# EAGLE schematic AP4BP-Module-CarrierBreakout_rev_a_v2 (EAGLE 9.7.0)
AUTHOR: Pat Pannuto; REV: B; TITLE: Apollo4-BluePlus-Module
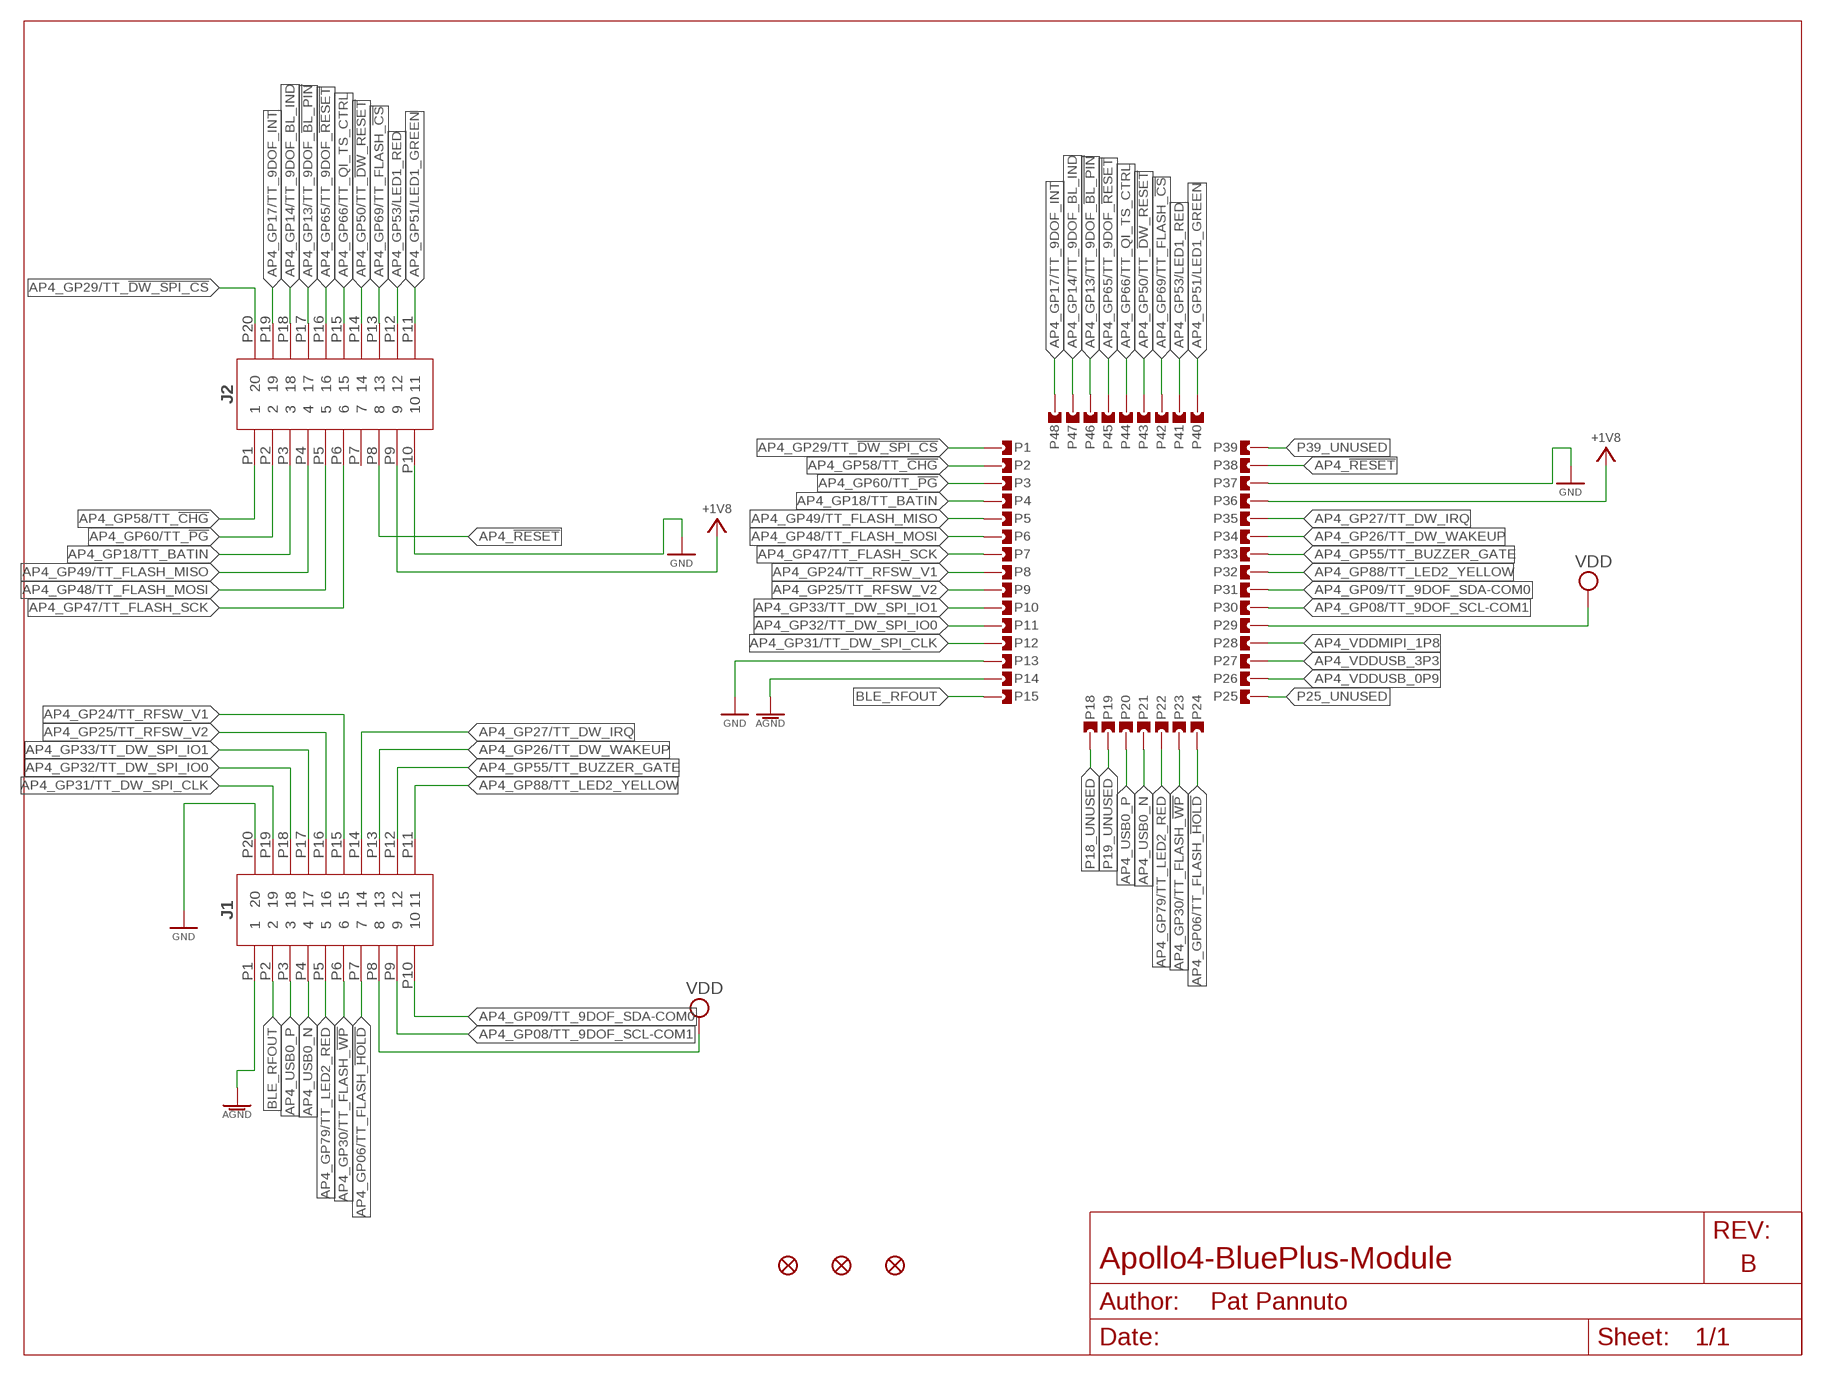
[diagram p0: schematic, sheet 1]

## Parts
FD1  FIDUCIALUFIDUCIAL  [FIDUCIAL-MICRO]
FD2  FIDUCIALUFIDUCIAL  [FIDUCIAL-MICRO]
FD3  FIDUCIALUFIDUCIAL  [FIDUCIAL-MICRO]
J1  PINHEAD-SMD-1MM-2X10  [PINHEAD-SMD-1MM-2X10]
J2  PINHEAD-SMD-1MM-2X10  [PINHEAD-SMD-1MM-2X10]
P1  CASTELLATION4L  [CASTELLATION-0.55MM_DRILL-4L]
P2  CASTELLATION4L  [CASTELLATION-0.55MM_DRILL-4L]
P3  CASTELLATION4L  [CASTELLATION-0.55MM_DRILL-4L]
P4  CASTELLATION4L  [CASTELLATION-0.55MM_DRILL-4L]
P5  CASTELLATION4L  [CASTELLATION-0.55MM_DRILL-4L]
P6  CASTELLATION4L  [CASTELLATION-0.55MM_DRILL-4L]
P7  CASTELLATION4L  [CASTELLATION-0.55MM_DRILL-4L]
P8  CASTELLATION4L  [CASTELLATION-0.55MM_DRILL-4L]
P9  CASTELLATION4L  [CASTELLATION-0.55MM_DRILL-4L]
P10  CASTELLATION4L  [CASTELLATION-0.55MM_DRILL-4L]
P11  CASTELLATION4L  [CASTELLATION-0.55MM_DRILL-4L]
P12  CASTELLATION4L  [CASTELLATION-0.55MM_DRILL-4L]
P13  CASTELLATION4L  [CASTELLATION-0.55MM_DRILL-4L]
P14  CASTELLATION4L  [CASTELLATION-0.55MM_DRILL-4L]
P15  CASTELLATION4L  [CASTELLATION-0.55MM_DRILL-4L]
P18  CASTELLATION4L  [CASTELLATION-0.55MM_DRILL-4L]
P19  CASTELLATION4L  [CASTELLATION-0.55MM_DRILL-4L]
P20  CASTELLATION4L  [CASTELLATION-0.55MM_DRILL-4L]
P21  CASTELLATION4L  [CASTELLATION-0.55MM_DRILL-4L]
P22  CASTELLATION4L  [CASTELLATION-0.55MM_DRILL-4L]
P23  CASTELLATION4L  [CASTELLATION-0.55MM_DRILL-4L]
P24  CASTELLATION4L  [CASTELLATION-0.55MM_DRILL-4L]
P25  CASTELLATION4L  [CASTELLATION-0.55MM_DRILL-4L]
P26  CASTELLATION4L  [CASTELLATION-0.55MM_DRILL-4L]
P27  CASTELLATION4L  [CASTELLATION-0.55MM_DRILL-4L]
P28  CASTELLATION4L  [CASTELLATION-0.55MM_DRILL-4L]
P29  CASTELLATION4L  [CASTELLATION-0.55MM_DRILL-4L]
P30  CASTELLATION4L  [CASTELLATION-0.55MM_DRILL-4L]
P31  CASTELLATION4L  [CASTELLATION-0.55MM_DRILL-4L]
P32  CASTELLATION4L  [CASTELLATION-0.55MM_DRILL-4L]
P33  CASTELLATION4L  [CASTELLATION-0.55MM_DRILL-4L]
P34  CASTELLATION4L  [CASTELLATION-0.55MM_DRILL-4L]
P35  CASTELLATION4L  [CASTELLATION-0.55MM_DRILL-4L]
P36  CASTELLATION4L  [CASTELLATION-0.55MM_DRILL-4L]
P37  CASTELLATION4L  [CASTELLATION-0.55MM_DRILL-4L]
P38  CASTELLATION4L  [CASTELLATION-0.55MM_DRILL-4L]
P39  CASTELLATION4L  [CASTELLATION-0.55MM_DRILL-4L]
P40  CASTELLATION4L  [CASTELLATION-0.55MM_DRILL-4L]
P41  CASTELLATION4L  [CASTELLATION-0.55MM_DRILL-4L]
P42  CASTELLATION4L  [CASTELLATION-0.55MM_DRILL-4L]
P43  CASTELLATION4L  [CASTELLATION-0.55MM_DRILL-4L]
P44  CASTELLATION4L  [CASTELLATION-0.55MM_DRILL-4L]
P45  CASTELLATION4L  [CASTELLATION-0.55MM_DRILL-4L]
P46  CASTELLATION4L  [CASTELLATION-0.55MM_DRILL-4L]
P47  CASTELLATION4L  [CASTELLATION-0.55MM_DRILL-4L]
P48  CASTELLATION4L  [CASTELLATION-0.55MM_DRILL-4L]

## Nets
+1V8: J2.P9 P36.P$1 P36.P$2 P36.P$3
AGND: J1.P1 P14.P$1 P14.P$2 P14.P$3
AP4_!RESET: J2.P8 P38.P$1 P38.P$2 P38.P$3
AP4_GP06/TT_FLASH_!HOLD: J1.P7 P24.P$1 P24.P$2 P24.P$3
AP4_GP08/TT_9DOF_SCL-COM1: J1.P9 P30.P$1 P30.P$2 P30.P$3
AP4_GP09/TT_9DOF_SDA-COM0: J1.P10 P31.P$1 P31.P$2 P31.P$3
AP4_GP13/TT_9DOF_!BL_PIN: J2.P17 P46.P$1 P46.P$2 P46.P$3
AP4_GP14/TT_9DOF_BL_IND: J2.P18 P47.P$1 P47.P$2 P47.P$3
AP4_GP17/TT_9DOF_INT: J2.P19 P48.P$1 P48.P$2 P48.P$3
AP4_GP18/TT_BATIN: J2.P3 P4.P$1 P4.P$2 P4.P$3
AP4_GP24/TT_RFSW_V1: J1.P15 P8.P$1 P8.P$2 P8.P$3
AP4_GP25/TT_RFSW_V2: J1.P16 P9.P$1 P9.P$2 P9.P$3
AP4_GP26/TT_DW_WAKEUP: J1.P13 P34.P$1 P34.P$2 P34.P$3
AP4_GP27/TT_DW_IRQ: J1.P14 P35.P$1 P35.P$2 P35.P$3
AP4_GP29/TT_!DW_SPI_CS: J2.P20 P1.P$1 P1.P$2 P1.P$3
AP4_GP30/TT_FLASH_!WP: J1.P6 P23.P$1 P23.P$2 P23.P$3
AP4_GP31/TT_DW_SPI_CLK: J1.P19 P12.P$1 P12.P$2 P12.P$3
AP4_GP32/TT_DW_SPI_IO0: J1.P18 P11.P$1 P11.P$2 P11.P$3
AP4_GP33/TT_DW_SPI_IO1: J1.P17 P10.P$1 P10.P$2 P10.P$3
AP4_GP47/TT_FLASH_SCK: J2.P6 P7.P$1 P7.P$2 P7.P$3
AP4_GP48/TT_FLASH_MOSI: J2.P5 P6.P$1 P6.P$2 P6.P$3
AP4_GP49/TT_FLASH_MISO: J2.P4 P5.P$1 P5.P$2 P5.P$3
AP4_GP50/TT_!DW_RESET: J2.P14 P43.P$1 P43.P$2 P43.P$3
AP4_GP51/LED1_GREEN: J2.P11 P40.P$1 P40.P$2 P40.P$3
AP4_GP53/LED1_RED: J2.P12 P41.P$1 P41.P$2 P41.P$3
AP4_GP55/TT_BUZZER_GATE: J1.P12 P33.P$1 P33.P$2 P33.P$3
AP4_GP58/TT_!CHG: J2.P1 P2.P$1 P2.P$2 P2.P$3
AP4_GP60/TT_!PG: J2.P2 P3.P$1 P3.P$2 P3.P$3
AP4_GP65/TT_9DOF_!RESET: J2.P16 P45.P$1 P45.P$2 P45.P$3
AP4_GP66/TT_QI_TS_CTRL: J2.P15 P44.P$1 P44.P$2 P44.P$3
AP4_GP69/TT_FLASH_!CS: J2.P13 P42.P$1 P42.P$2 P42.P$3
AP4_GP79/TT_LED2_RED: J1.P5 P22.P$1 P22.P$2 P22.P$3
AP4_GP88/TT_LED2_YELLOW: J1.P11 P32.P$1 P32.P$2 P32.P$3
AP4_USB0_N [USB_PHY]: J1.P4 P21.P$1 P21.P$2 P21.P$3
AP4_USB0_P [USB_PHY]: J1.P3 P20.P$1 P20.P$2 P20.P$3
AP4_VDDMIPI_1P8: P28.P$1 P28.P$2 P28.P$3
AP4_VDDUSB_0P9: P26.P$1 P26.P$2 P26.P$3
AP4_VDDUSB_3P3: P27.P$1 P27.P$2 P27.P$3
BLE_RFOUT [BLE_PHY]: J1.P2 P15.P$1 P15.P$2 P15.P$3
GND: J1.P20 J2.P10 P13.P$1 P13.P$2 P13.P$3 P37.P$1 P37.P$2 P37.P$3
P18_UNUSED: P18.P$1 P18.P$2 P18.P$3
P19_UNUSED: P19.P$1 P19.P$2 P19.P$3
P25_UNUSED: P25.P$1 P25.P$2 P25.P$3
P39_UNUSED: P39.P$1 P39.P$2 P39.P$3
VDD: J1.P8 P29.P$1 P29.P$2 P29.P$3
Unconnected: J2.P7

## Library data of the parts
FD1-FD3 = SparkFun-Aesthetics:FIDUCIAL: Fiducial Alignment Points Point-of-reference for pick-and-place machines and other optical instruments.
J1 J2 = connector:PINHEAD-SMD-1MM-2X10; DESCRIPTION: SCL 1.0 HDR DRVT USP 020 SMT G3; DIGIKEY: 17-1MM-HU-D10-VS-00-H-TBP-ND; MANUFACTURER: TE Connectivity AMP Connectors; MPN: 1MM-HU-D10-VS-00-H-TBP
P1-P15 P18-P48 = connector:CASTELLATION: Castellation 0.55 mm drill, 1.27 mm pitch – Matches ESP32

## Net classes
1 USB_PHY: width 0.152 mm, clearance 0.305 mm
2 BLE_PHY: width 0.203 mm, clearance 0.095 mm